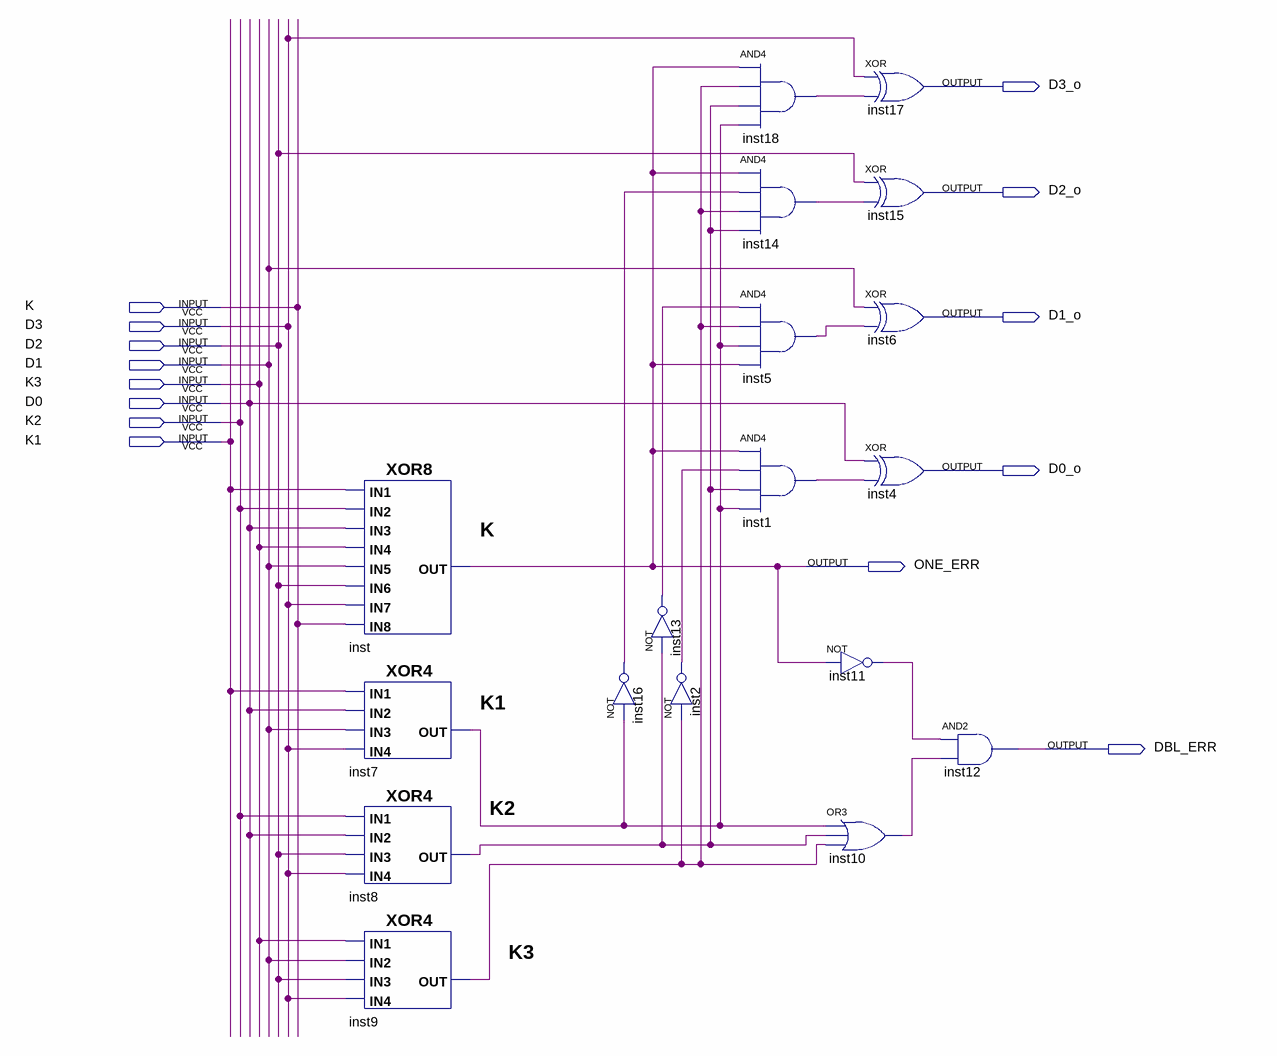
[diagram p0: schematic sheet]
// Quartus schematic DC_g.bdf as structural Verilog: 18 symbols, 14 pins
module DC_g (
  input  K,
  input  D3,
  input  D2,
  input  D1,
  input  K3,
  input  D0,
  input  K2,
  input  K1,
  output D3_o,
  output D2_o,
  output D1_o,
  output D0_o,
  output ONE_ERR,
  output DBL_ERR
);

  wire inst1_out, inst2_out, inst5_out, inst7_out, inst8_out, inst9_out, inst10_out, inst11_out, inst13_out,
       inst14_out, inst16_out, inst18_out;

  XOR8 inst (.IN8(K), .IN1(K1), .IN7(D3), .IN6(D2), .IN5(D1), .IN4(K3), .IN3(D0), .IN2(K2), .OUT(ONE_ERR));
  XOR4 inst7 (.IN3(D1), .IN4(D3), .IN2(D0), .IN1(K1), .OUT(inst7_out));
  XOR4 inst8 (.IN3(D2), .IN4(D3), .IN2(D0), .IN1(K2), .OUT(inst8_out));
  XOR4 inst9 (.IN3(D2), .IN4(D3), .IN2(D1), .IN1(K3), .OUT(inst9_out));
  not inst13 (inst13_out, inst8_out);
  not inst16 (inst16_out, inst7_out);
  not inst2 (inst2_out, inst9_out);
  and inst18 (inst18_out, ONE_ERR, inst9_out, inst8_out, inst7_out);
  and inst14 (inst14_out, ONE_ERR, inst16_out, inst9_out, inst8_out);
  and inst5 (inst5_out, inst13_out, inst9_out, inst7_out, ONE_ERR);
  and inst1 (inst1_out, ONE_ERR, inst2_out, inst8_out, inst7_out);
  xor inst17 (D3_o, D3, inst18_out);
  xor inst15 (D2_o, D2, inst14_out);
  xor inst6 (D1_o, D1, inst5_out);
  xor inst4 (D0_o, D0, inst1_out);
  not inst11 (inst11_out, ONE_ERR);
  or inst10 (inst10_out, inst7_out, inst8_out, inst9_out);
  and inst12 (DBL_ERR, inst11_out, inst10_out);

  // Notes on the sheet:
  //   K
  //   K1
  //   K2
  //   K3
endmodule
